# EasyEDA schematic SCH_Pico to Rpi4_2023-11-27.json
TITLE: Pico DiRPi Hat; REV: 1.0; Date: 2023-06-16; Sheet: 1/1; Drawn By: eliottschaffer; Company: Univ. of Calif. Santa Barbara
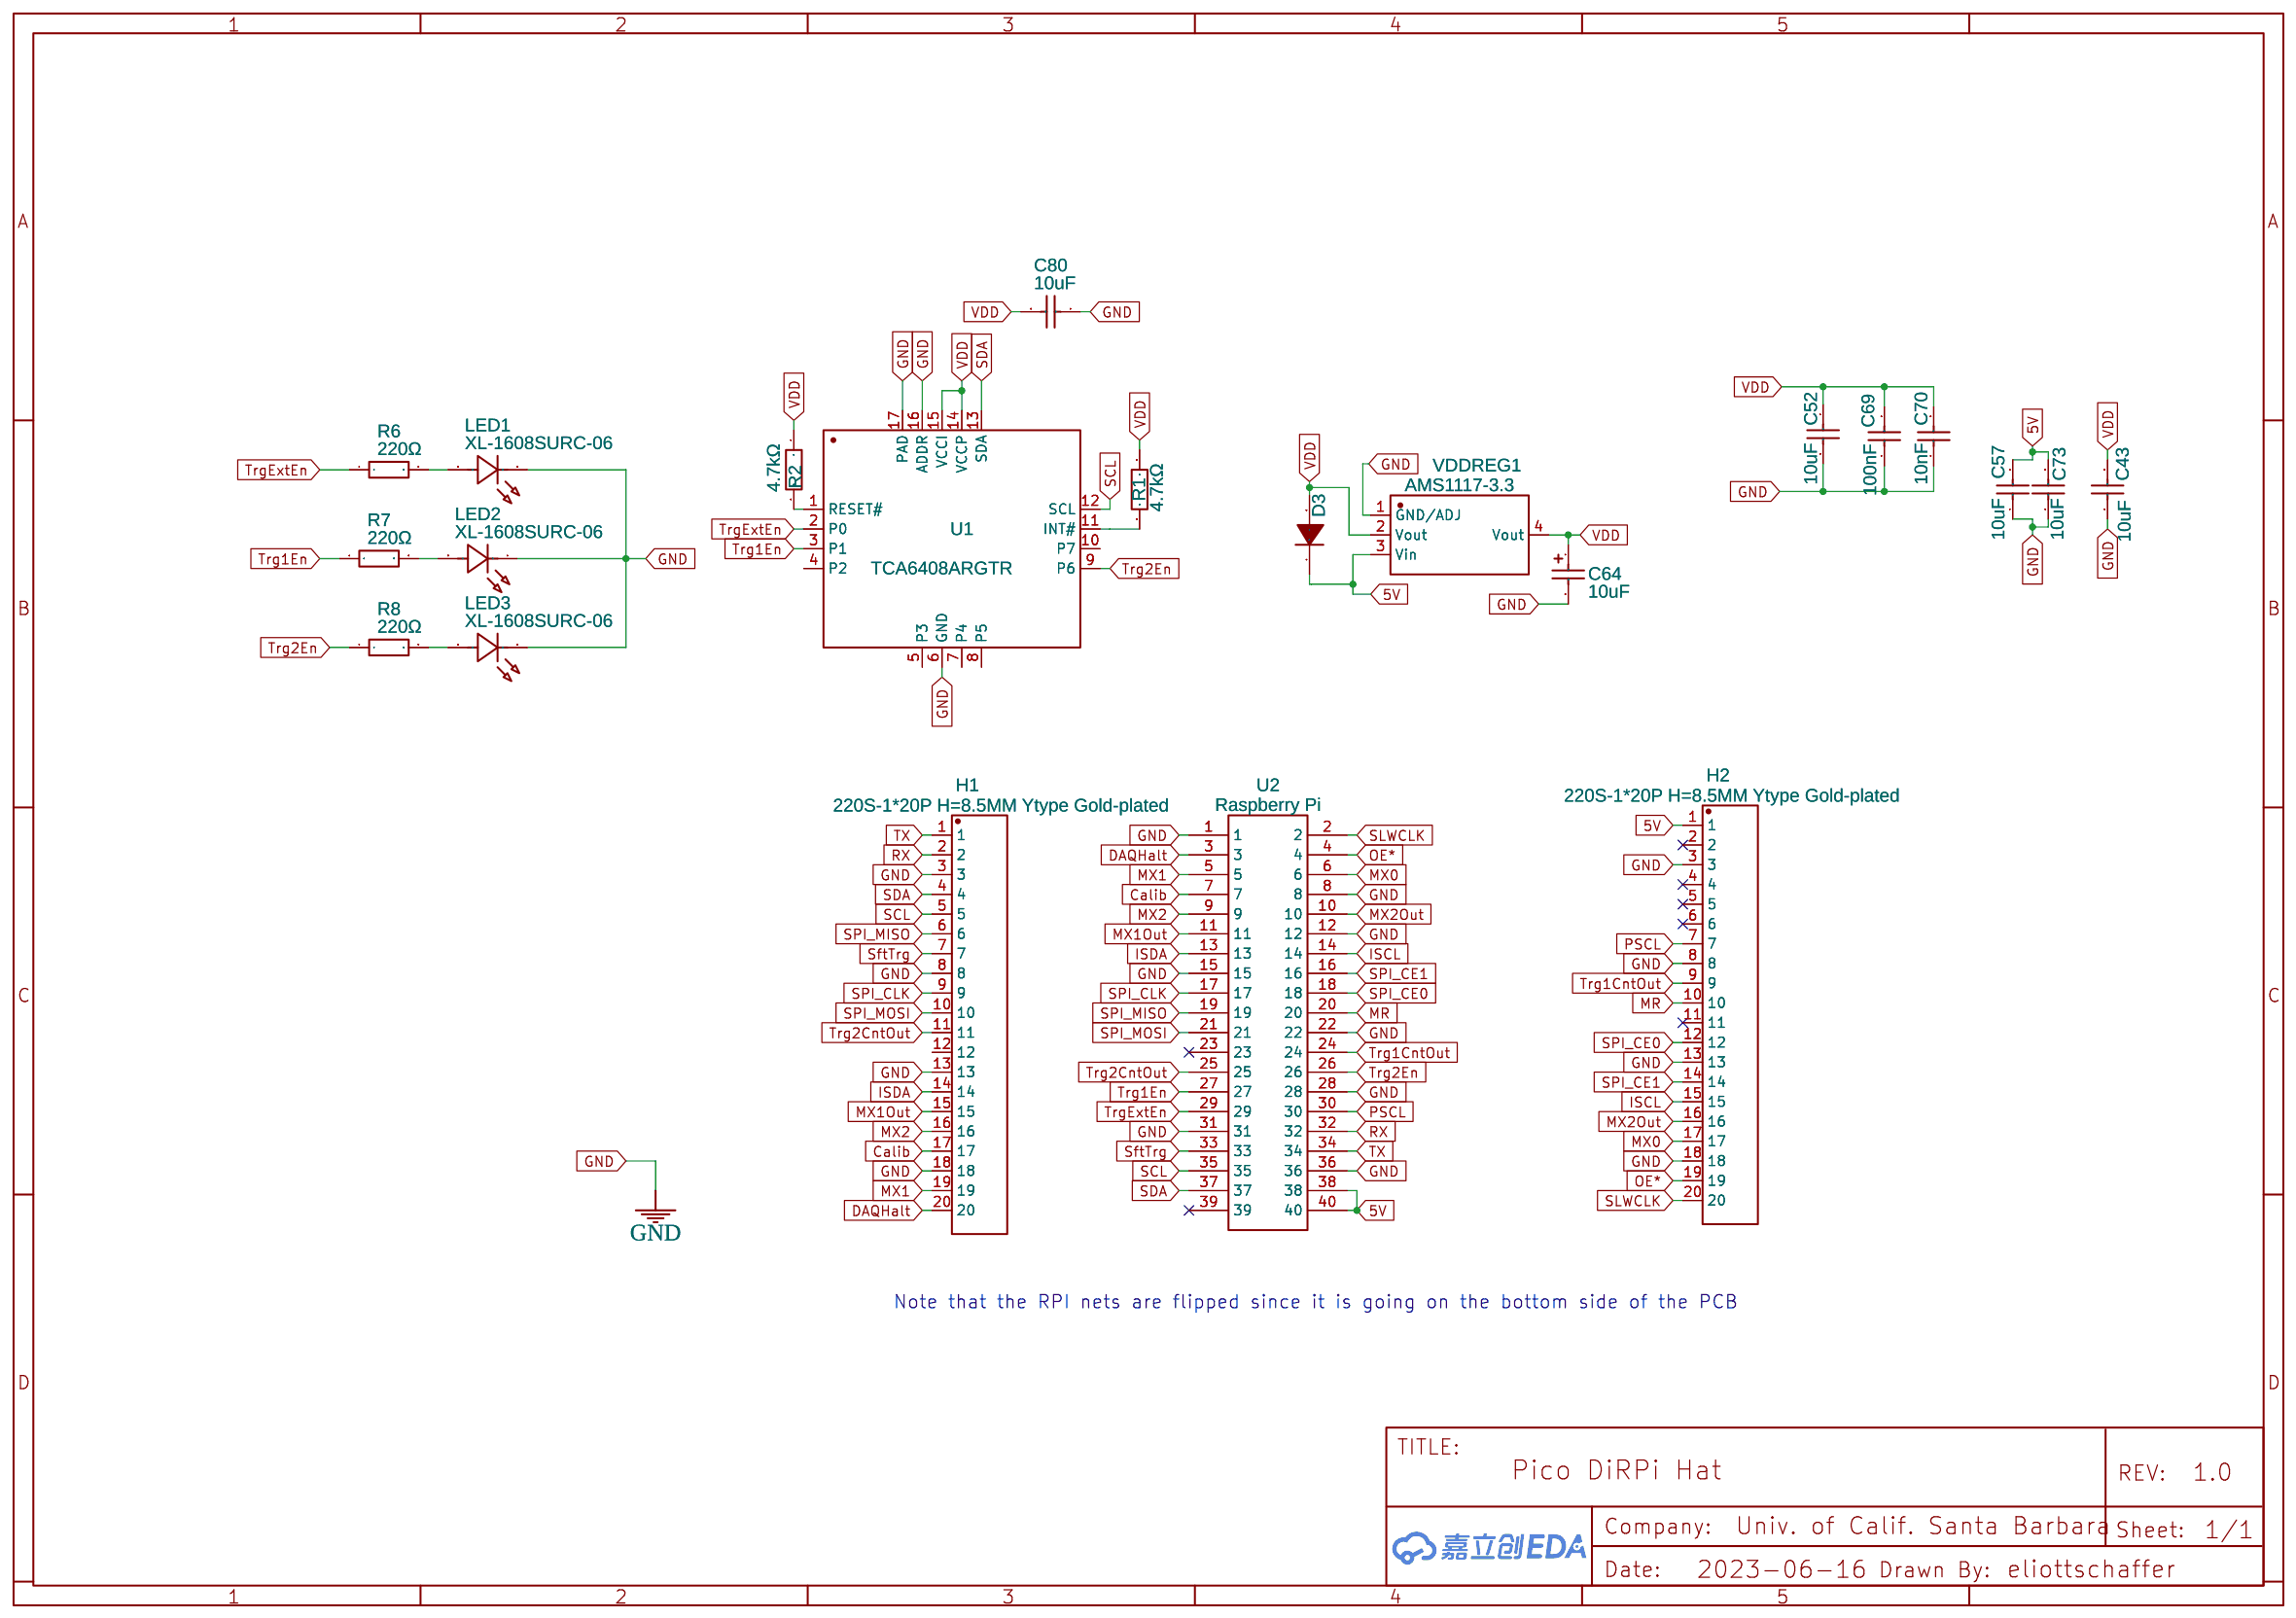
[diagram p0: schematic sheet]

## Parts
C43  10uF  [C0402]
C52  10uF  [C0402]
C57  10uF  [C0402]
C64  10uF  [CAP-SMD_L3.2-W1.6-RD-C7171]
C69  100nF  [C0402]
C70  10nF  [C0402]
C73  10uF  [C0402]
C80  10uF  [C0402]
D3  M7_C95872  [DO-214AC_L4.3-W2.7-LS5.3-RD]
H1  220S-1*20P H=8.5MM Ytype Gold-plated  [HDR-TH_20P-P2.54-V-F]
H2  220S-1*20P H=8.5MM Ytype Gold-plated  [HDR-TH_20P-P2.54-V-F]
LED1  XL-1608SURC-06  [LED0603-RD_RED]
LED2  XL-1608SURC-06  [LED0603-RD_RED]
LED3  XL-1608SURC-06  [LED0603-RD_RED]
R1  4.7kΩ  [R0402]
R2  4.7kΩ  [R0402]
R6  220Ω  [R0805]
R7  220Ω  [R0805]
R8  220Ω  [R0805]
U1  TCA6408ARGTR  [QFN-16_L3.0-W3.0-P0.50-BL-EP1.7]
U2  Raspberry Pi  [HDR-TH_40P-P2.54-V-F-R2-C20-S2.54]
VDDREG1  AMS1117-3.3  [SOT-223-3_L6.5-W3.4-P2.30-LS7.0-BR]

## Library data of the parts
C43 C52 C57 C73 C80 = CL05A106MQ5NUNC: Supplier: LCSC; Manufacturer: SAMSUNG; LCSC Assembly: Yes; Supplier Part: C15525; SMT Type: Basic
C64 = TAJA106K016RNJ: Supplier: LCSC; Manufacturer: AVX; Supplier Part: C7171; JLCPCB Part Class: Basic Part
C69 = CL05B104KO5NNNC: Supplier: LCSC; Manufacturer: SAMSUNG; LCSC Assembly: Yes; Supplier Part: C1525; SMT Type: Basic
C70 = CL05B103KB5NNNC: Supplier: LCSC; Manufacturer: SAMSUNG; Supplier Part: C15195; JLCPCB Part Class: Basic Part
D3 = M7_C95872: Supplier: LCSC; Manufacturer: MDD; Manufacturer Part: M7; Supplier Part: C95872; JLCPCB Part Class: Basic Part
H1 H2 = 220S-1*20P H=8.5MM Ytype Gold-plated: Supplier: LCSC; Manufacturer: Ckmtw(灿科盟); Manufacturer Part: B-2200S20P-A120; Contributor: LCSC; Supplier Part: C124410; JLCPCB Part Class: Extended Part
LED1-LED3 = XL-1608SURC-06: Supplier: LCSC; Supplier Part: C965799; Manufacturer: XINGLIGHT(成兴光); JLCPCB Part Class: Extended Part; Contributor: LCSC
R1 R2 = 0402WGF4701TCE: Supplier: LCSC; Manufacturer: UniOhm; Supplier Part: C25900; Resistance (Ohms): 4.7K; JLCPCB Part Class: Basic Part
R6-R8 = AC0805FR-07220RL: Supplier: LCSC; Manufacturer: YAGEO(国巨); Supplier Part: C138270; JLCPCB Part Class: Extended Part; link: https://lcsc.com/eda_search?q=C138270&%26type=1&ref=editor
U1 = TCA6408ARGTR: Supplier: LCSC; Manufacturer: TI(德州仪器); Contributor: LCSC; Supplier Part: C181499; JLCPCB Part Class: Extended Part
U2 = 2.54-2*20: Supplier: LCSC; Supplier Part: C2977589; Manufacturer: ZHOURI(洲日); link: https://atta.szlcsc.com/upload/public/pdf/source/20220328/834E302BE3C038BBC5C70F5E02589B1E.pdf; Contributor: LCSC; JLCPCB Part Class: Extended Part
VDDREG1 = AMS1117-3.3: sourceId: dwIGgezVh; Supplier: LCSC; Manufacturer: AMS; Supplier Part: C6186; JLCPCB Part Class: Basic Part

## Nets
5V: C57.2 C73.2 D3.1(K) H2.1 U2.38 U2.40 VDDREG1.3(Vin)
GND: C43.1 C52.2 C57.1 C64.2 C69.1 C70.1 C73.1 C80.1 H1.3 H1.8 H1.13 H1.18 H2.3 H2.8 H2.13 H2.18 LED1.1(K) LED2.1(K) LED3.1(K) U1.6(GND) U1.16(ADDR) U1.17(PAD) U2.1 U2.8 U2.12 U2.15 U2.22 U2.28 U2.31 U2.36 VDDREG1.1(GND/ADJ)
VDD: C43.2 C52.1 C64.1 C69.2 C70.2 C80.2 D3.2(A) R1.1 R2.1 U1.14(VCCP) U1.15(VCCI) VDDREG1.2(Vout) VDDREG1.4(Vout)
Calib: H1.17 U2.7
DAQHalt: H1.20 U2.3
ISCL: H2.15 U2.14
ISDA: H1.14 U2.13
MR: H2.10 U2.20
MX0: H2.17 U2.6
MX1: H1.19 U2.5
MX1Out: H1.15 U2.11
MX2: H1.16 U2.9
MX2Out: H2.16 U2.10
OE*: H2.19 U2.4
PSCL: H2.7 U2.30
RX: H1.2 U2.32
SCL: H1.5 U1.12(SCL) U2.35
SDA: H1.4 U1.13(SDA) U2.37
SftTrg: H1.7 U2.33
SLWCLK: H2.20 U2.2
SPI_CE0: H2.12 U2.18
SPI_CE1: H2.14 U2.16
SPI_CLK: H1.9 U2.17
SPI_MISO: H1.6 U2.19
SPI_MOSI: H1.10 U2.21
Trg1CntOut: H2.9 U2.24
Trg1En: R7.1 U1.3(P1) U2.27
Trg2CntOut: H1.11 U2.25
Trg2En: R8.1 U1.9(P6) U2.26
TrgExtEn: R6.1 U1.2(P0) U2.29
TX: H1.1 U2.34
Net-(LED1-2): LED1.2(A) R6.2
Net-(LED2-2): LED2.2(A) R7.2
Net-(LED3-2): LED3.2(A) R8.2
Net-(R1-2): R1.2 U1.11(INT#)
Net-(R2-2): R2.2 U1.1(RESET#)

Not connected (* = marked no-connect by the designer): H1 12; H2 2* 4* 5* 6* 11*; U1 4(P2) 5(P3) 7(P4) 8(P5) 10(P7); U2 23* 39*

## Notes on the sheet
- Note that the RPI nets are flipped since it is going on the bottom side of the PCB
